# EAGLE design lsm6dso-breakout (EAGLE 9.6.2)
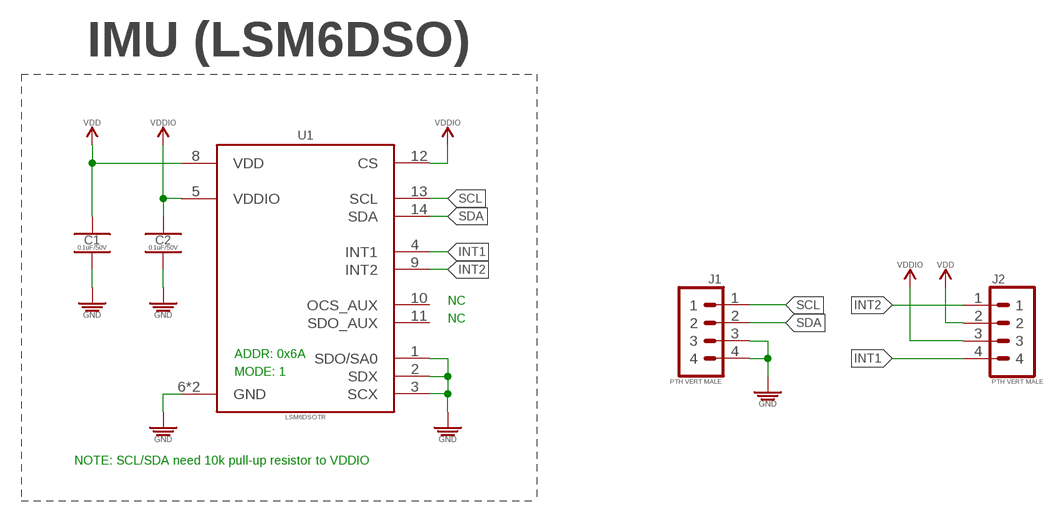
[diagram p0: schematic, sheet 1]

## Parts
C1  0.1uF/50V  0.1UF_SMD-0402_50V-10%  [CAPC1005X55_SMD-0402]
C2  0.1uF/50V  0.1UF_SMD-0402_50V-10%  [CAPC1005X55_SMD-0402]
J1  PTH VERT MALE  1X04_PTH_VERT_MALE_2.54MM  [HDRV4W64P254_1X4_1016X254X838B]
J2  PTH VERT MALE  1X04_PTH_VERT_MALE_2.54MM  [HDRV4W64P254_1X4_1016X254X838B]
U1  LSM6DSOTR  LSMDSO  [QFN50P250X300X86-14N]

## Nets
GND: C1.2 C2.2 J1.3 J1.4 U1.1(SDO/SA0) U1.2(SDX) U1.3(SCX) U1.6(GND) U1.7(GND)
INT1: J2.4 U1.4(INT1)
INT2: J2.1 U1.9(INT2)
SCL: J1.1 U1.13(SCL)
SDA: J1.2 U1.14(SDA)
VDD: C1.1 J2.2 U1.8(VDD)
VDDIO: C2.1 J2.3 U1.5(VDDIO) U1.12(CS)
Unconnected: U1.10(OCS_AUX) U1.11(SDO_AUX)

## Notes on the sheet
- IMU (LSM6DSO)
- NC
- NC
- ADDR: 0x6A
- MODE: 1
- NOTE: SCL/SDA need 10k pull-up resistor to VDDIO

## Library data of the parts
C1 C2 = _capacitors:0.1UF; DATASHEET: https://product.tdk.com/info/en/catalog/datasheets/mlcc_commercial_soft_en.pdf; DIST: Digikey; DISTLINK: https://www.digikey.com/products/en?keywords=445-173610-1-ND; DISTPN: 445-173610-1-ND; MFR: TDK Corporation; MPN: C1005X7R1H104K050BE
J1 J2 = _connectors:1X04; DATASHEET: https://drawings-pdf.s3.amazonaws.com/C10436.pdf; DIST: Digikey; DISTLINK: https://www.digikey.com/products/en?keywords=PEC04SAAN; DISTPN: S1012E-04-ND; MFR: Sullins Connector Solutions; MPN: PEC04SAAN
U1 = _sensors:LSMDSO: Accelerometer, Gyroscope, 6 Axis Sensor I²C, SPI Output; DATASHEET: https://www.st.com/resource/en/datasheet/lsm6dso.pdf; DIST: Digikey; DISTLINK: https://www.digikey.com/en/products/detail/stmicroelectronics/LSM6DSOTR/9586579?s=N4IgTCBcDaICwE4DsBaAjADk29KByAIiALoC%2BQA; DISTPN: 497-18181-1-ND; MFR: STMicroelectronics; MPN: LSM6DSOTR

## Board
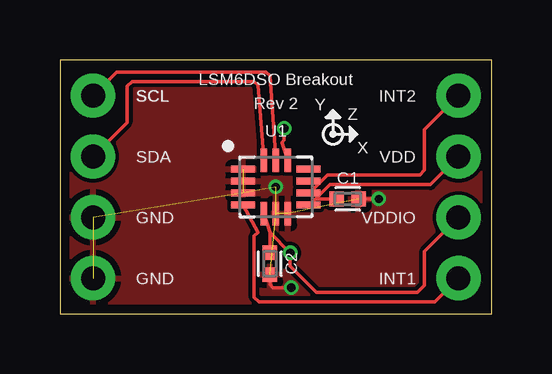
[diagram p1: board, top side]
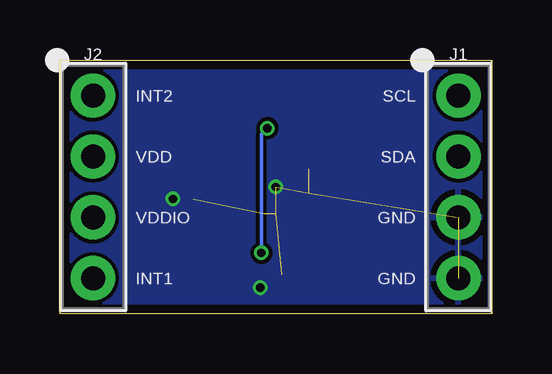
[diagram p2: board, bottom side, seen from below]

Size 18 x 10.6 mm. Coordinates in mm from the lower left corner, seen from the top.
Outline: 0,0 18,0 18,10.6 0,10.6 0,0
Copper layers (1*16): Top 0.035559375mm / dielectric 1.6mm / Bottom 0.035559375mm
Design rules "oshpark-2layer": minimum track width 6mil, minimum drill 10mil, track to track 6mil, track to pad 6mil, pad to pad 6mil, via to via 6mil, smd to smd 6mil, copper to edge 15mil, drill to drill 6mil, minimum pad ring 5mil, minimum via ring 5mil, stop-mask expansion 2.5mil, vias tented up to drill 0mil, thermal gap 10mil

### Footprints (pad centres in the part's own frame; a part is rotated, then mirrored left to right if it is on the bottom)
CAPC1005X55_SMD-0402 = smd 0.585 x 0.612: 1 -0.458,0; 2 0.458,0
HDRV4W64P254_1X4_1016X254X838B = drill 1 pad 1.85: 1 -3.81,0; 2 -1.27,0; 3 1.27,0; 4 3.81,0
QFN50P250X300X86-14N = smd 0.987 x 0.282: 1 -1.363,0.75; 2 -1.363,0.25; 3 -1.363,-0.25; 4 -1.363,-0.75; 8 1.363,-0.75; 9 1.363,-0.25; 10 1.363,0.25; 11 1.363,0.75 | smd 0.282 x 0.987: 5 -0.5,-1.113; 6 0,-1.113; 7 0.5,-1.113; 12 0.5,1.113; 13 0,1.113; 14 -0.5,1.113

### Placement (x,y rotation side)
C1  12,4.8 0 top
C2  8.75,2.1 270 top
J1  1.38,5.3 270 bottom
J2  16.62,5.3 270 bottom
U1  9,5.3 0 top

### Tracks (layer width: path | path; a pad name or v marks a point on that pad's centre or on a via)
GND  (via drill 0.35 pad 0.15)  (9 unrouted)
  Top 0.152: C2.2 8.75,1.24 8.89,1.1 v9.65,1.1 | C1.2 v13.3,4.8
  other vias: 9,5.3
  pour Bottom (rank 6): 0,0 18,0 18,10.6 0,10.6
  pour Top (rank 6): 0,0 18,0 18,10.6 0,10.6
INT1
  Top 0.152: U1.4 8.25,3.4 8.1,3.25 8.1,0.7 8.3,0.5 15.63,0.5 J2.4
INT2
  Top 0.152: U1.9 10.65,5.3 11.15,5.8 15,5.8 15.2,6 15.2,7.69 J2.1
SCL
  Top 0.152: J1.1 2.37,10.1 8.6,10.1 8.75,9.95 U1.13
SDA
  Top 0.152: J1.2 2.8,7.99 2.8,9.5 3,9.7 8.1,9.7 8.25,9.55 U1.14
VDD
  Top 0.152: U1.8 10.65,4.8 | 10.65,4.8 11.25,5.4 15.45,5.4 J2.2 | C1.1 10.65,4.8
VDDIO  (via drill 0.35 pad 0.15)
  Top 0.152: U1.12 9.25,7.16 9.35,7.26 v9.35,7.75 | U1.5 8.75,3.4 | 8.75,3.4 v9.6,2.55 9.6,2 10.7,0.9 14.9,0.9 15.2,1.2 15.2,2.61 J2.3 | C2.1 8.75,3.4
  Bottom 0.152: v9.6,2.55 9.6,7.5 v9.35,7.75

### Text on the board
tPlace: SCL | SCL | LSM6DSO Breakout | Rev 2 | INT2 | SDA | VDD | GND | VDDIO | GND | INT1
bPlace: SCL | INT2 | SDA | VDD | GND | VDDIO | GND | INT1